# Altium schematic sheet Downstream_Port.SchDoc: Downstream Port
size 431 x 279 mm; Author: Eric Liu; SheetNumber: 2; SheetTotal: 6
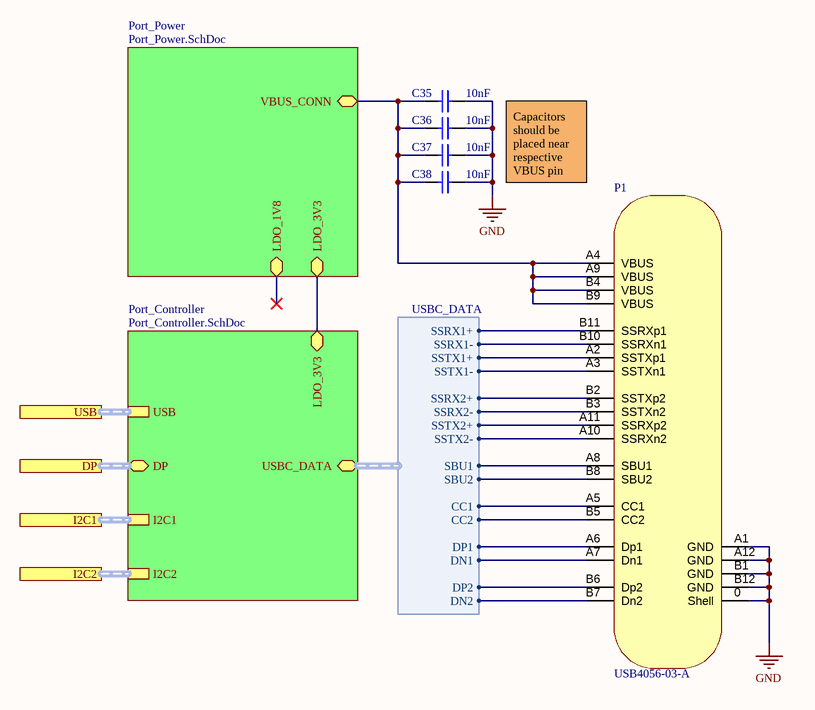
[diagram p0: Downstream_Port.SchDoc]

## Parts
C35  value 10nF  [CAP0402]  (hidden comment: CC0402KRX7R9BB103)
C36  value 10nF  [CAP0402]  (hidden comment: CC0402KRX7R9BB103)
C37  value 10nF  [CAP0402]  (hidden comment: CC0402KRX7R9BB103)
C38  value 10nF  [CAP0402]  (hidden comment: CC0402KRX7R9BB103)
P1  USB4056-03-A  [USB4056-03-A]

## Sub-sheets
Port_Controller = Port_Controller.SchDoc: USB (harness USB), I2C1 (harness USB), DP (bidir, harness DP), USBC_DATA (bidir, harness USBC_DATA), LDO_3V3 (bidir), I2C2 (harness USB)
Port_Power = Port_Power.SchDoc: LDO_3V3 (bidir), LDO_1V8 (bidir), VBUS_CONN (bidir)

## Ports
DP, I2C1, I2C2, USB

## Harnesses
USBC_DATA: SSRX1+, SSRX1-, SSTX1+, SSTX1-, SSRX2+, SSRX2-, SSTX2+, SSTX2-, CC1, CC2, SBU1, SBU2, DP1, DN1, DP2, DN2

## Nets
GND: C35.1 C36.1 C37.1 C38.1 P1.0(Shell) P1.A1(GND) P1.A12(GND) P1.B1(GND) P1.B12(GND)
NetC35_2: C35.2 C36.2 C37.2 C38.2 P1.A4(VBUS) P1.A9(VBUS) P1.B4(VBUS) P1.B9(VBUS) ; sheet Port_Power/VBUS_CONN
NetP1_A2: P1.A2(SSTXp1) ; sheet Port_Controller/USBC_DATA.SSTX1+
NetP1_A3: P1.A3(SSTXn1) ; sheet Port_Controller/USBC_DATA.SSTX1-
NetP1_A5: P1.A5(CC1) ; sheet Port_Controller/USBC_DATA.CC1
NetP1_A6: P1.A6(Dp1) ; sheet Port_Controller/USBC_DATA.DP1
NetP1_A7: P1.A7(Dn1) ; sheet Port_Controller/USBC_DATA.DN1
NetP1_A8: P1.A8(SBU1) ; sheet Port_Controller/USBC_DATA.SBU1
NetP1_A10: P1.A10(SSRXn2) ; sheet Port_Controller/USBC_DATA.SSTX2-
NetP1_A11: P1.A11(SSRXp2) ; sheet Port_Controller/USBC_DATA.SSTX2+
NetP1_B2: P1.B2(SSTXp2) ; sheet Port_Controller/USBC_DATA.SSRX2+
NetP1_B3: P1.B3(SSTXn2) ; sheet Port_Controller/USBC_DATA.SSRX2-
NetP1_B5: P1.B5(CC2) ; sheet Port_Controller/USBC_DATA.CC2
NetP1_B6: P1.B6(Dp2) ; sheet Port_Controller/USBC_DATA.DP2
NetP1_B7: P1.B7(Dn2) ; sheet Port_Controller/USBC_DATA.DN2
NetP1_B8: P1.B8(SBU2) ; sheet Port_Controller/USBC_DATA.SBU2
NetP1_B10: P1.B10(SSRXn1) ; sheet Port_Controller/USBC_DATA.SSRX1-
NetP1_B11: P1.B11(SSRXp1) ; sheet Port_Controller/USBC_DATA.SSRX1+
(unnamed): sheet Port_Controller/LDO_3V3, sheet Port_Power/LDO_3V3

## Buses and harness runs
harness port DP = sheet Port_Controller/DP
harness port I2C1 = sheet Port_Controller/I2C1
harness port I2C2 = sheet Port_Controller/I2C2
harness port USB = sheet Port_Controller/USB

## Notes on the sheet
- Capacitors should be placed near respective VBUS pin
- DWG. NO.
- REV.
- SHT.
- THIS DOCUMENT AND THE DATA DISCLOSED HEREIN OR HEREWITH IS THE PROPERTY OF ALTIUM LIMITED AND MAY BE FREELY DISTRIBUTED IN WHOLE. NO RIGHTS ARE RESERVED OR EXPRESS OR IMPLIED WARANTEE GIVEN.
- REVISION
- DESCRIPTION
- DATE
- APPROVED
- ENG:
- APPROVALS
- PROJECT
- DSN:
- CHK:
- REFERENCE DOCUMENTS
- PROJECT REVISION:
- TITLE
- DOCUMENT REVISION:
- DESIGN ITEM:
- BOM:
- FAB DWG:
- PCB DWG:
- ASSY DWG:
- SCALE:
- SIZE
- B
- CAGE CODE
- FILE NAME
- DWG NO.
- SHEET
- OF
- REV

## Library data of the parts
C35-C38 = CC0402KRX7R9BB103: 10000 pF ±10% 50V Ceramic Capacitor X7R 0402 (1005 Metric); Temperature Coefficient: X7R; Package: 0402 (1005 Metric); Voltage: 50V
P1 = USB4056-03-A: USB-C (USB TYPE-C) USB 3.2 Gen 2 (USB 3.1 Gen 2, Superspeed + (USB 3.1)) Receptacle Connector 24 Position Surface Mount, Right Angle; Through Hole; Manufacturer: GCT; Voltage: 48VDC; Manufacturer Product Number: USB4056-03-A; Supplier: DigiKey; Supplier Part Number: 2073-USB4056-03-ACT-ND; Datasheet: https://gct.co/connector/usb4056; Standards: USB 3.2 Gen 2; Operating Temperature: -25°C ~ 85°C